# EAGLE schematic ArduinoShield_v1 (EAGLE 7.4.0)
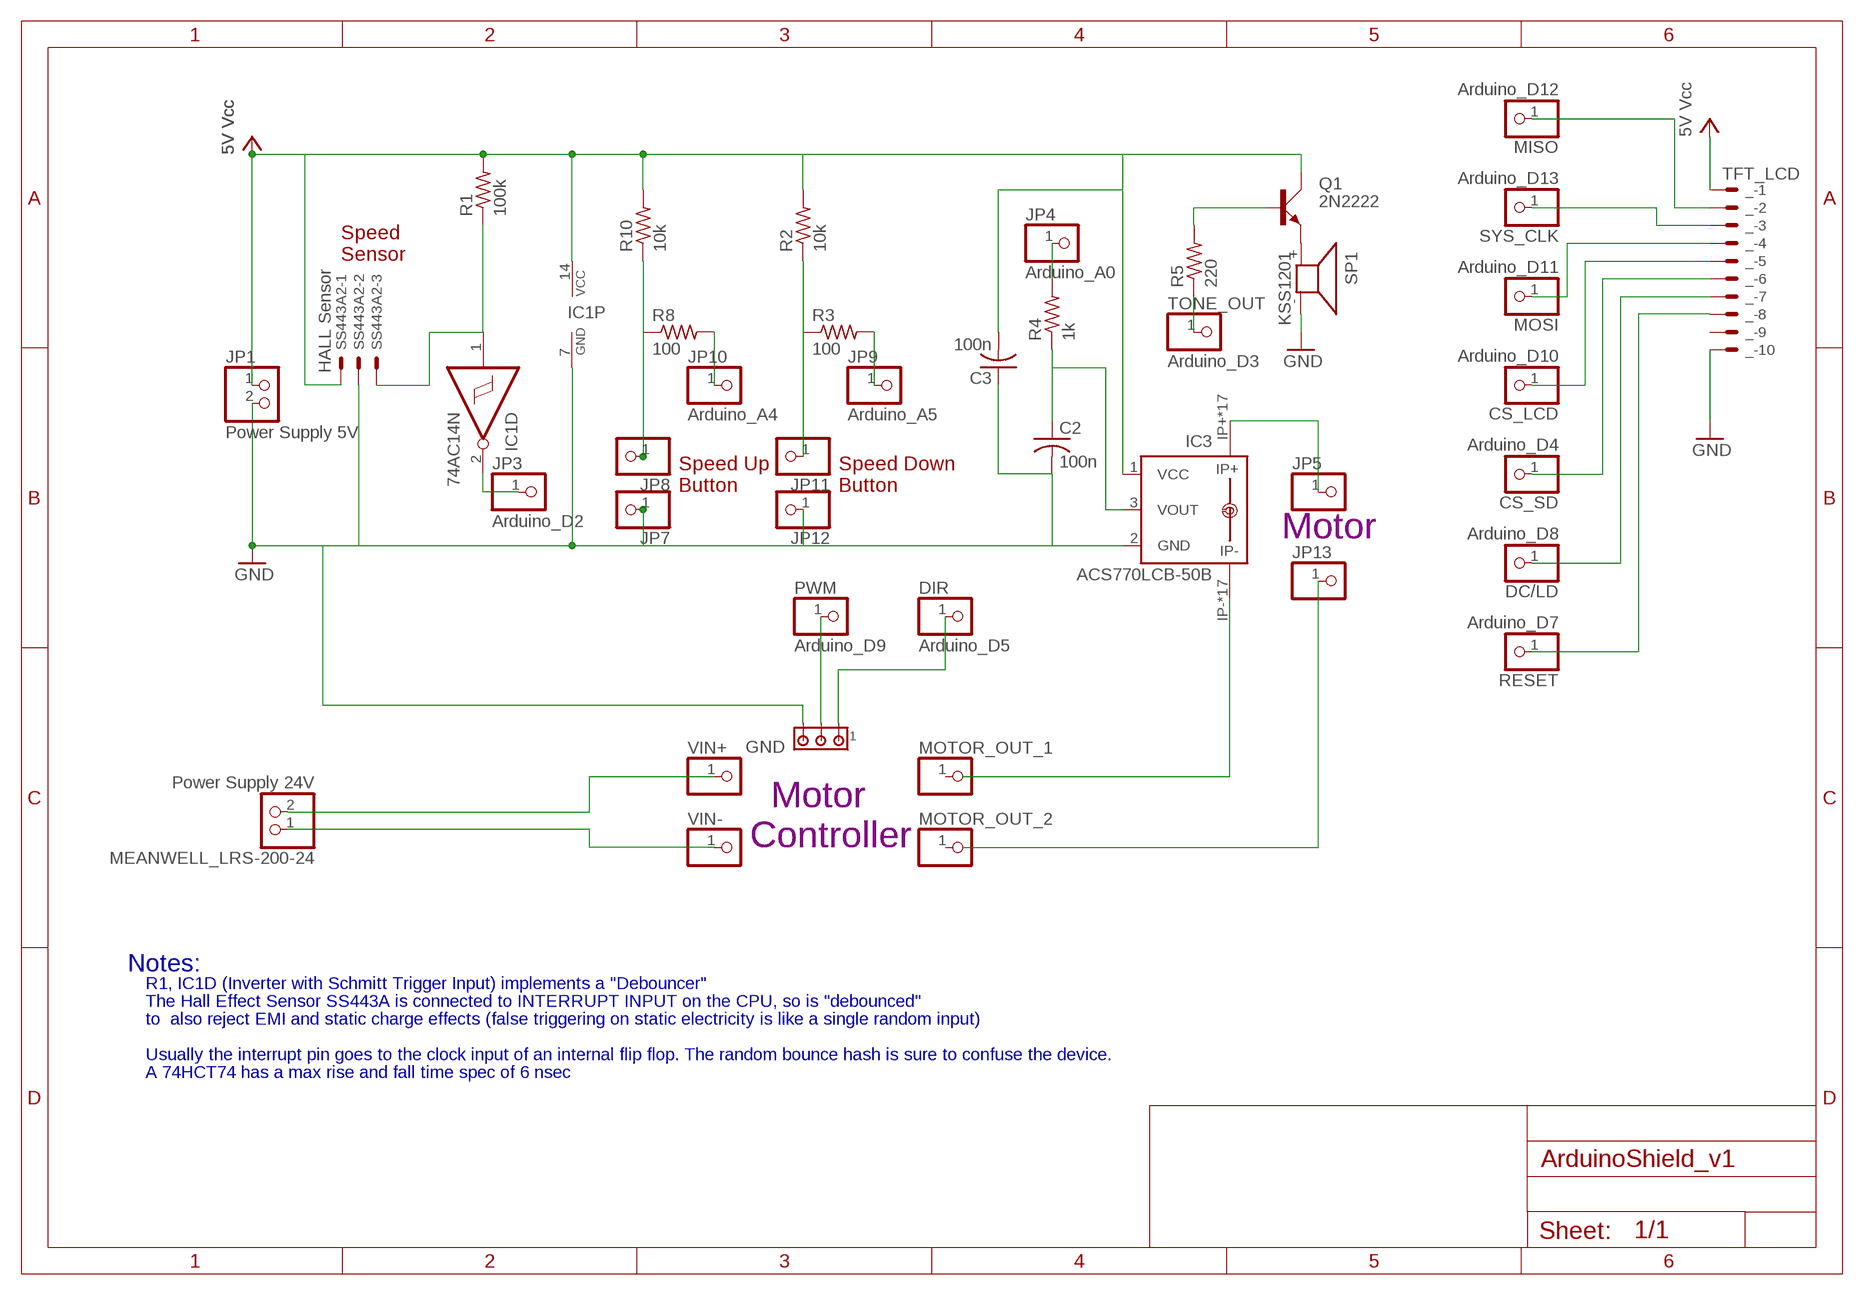
[diagram p0: schematic, sheet 1]

## Parts
_  TFT_LCD  22-23-2101  [22-23-2101]
C2  100n  C-US050-030X075  [C050-030X075]
C3  100n  C-US050-030X075  [C050-030X075]
CS_LCD  Arduino_D10  PINHD-1X1  [1X01]
CS_SD  Arduino_D4  PINHD-1X1  [1X01]
DC/LD  Arduino_D8  PINHD-1X1  [1X01]
DIR  Arduino_D5  PINHD-1X1  [1X01]
GND  350429-1  [350429-1]
IC1  74AC14N  [DIL14]
IC3  ACS770LCB-50B  ACS750LCA-050  [ACS75050]
JP1  Power Supply 5V  PINHD-1X2  [1X02]
JP3  Arduino_D2  PINHD-1X1  [1X01]
JP4  Arduino_A0  PINHD-1X1  [1X01]
JP5  PINHD-1X1  [1X01]
JP7  PINHD-1X1  [1X01]
JP8  PINHD-1X1  [1X01]
JP9  Arduino_A5  PINHD-1X1  [1X01]
JP10  Arduino_A4  PINHD-1X1  [1X01]
JP11  PINHD-1X1  [1X01]
JP12  PINHD-1X1  [1X01]
JP13  PINHD-1X1  [1X01]
MEANWELL_LRS-200-24  Power Supply 24V  PINHD-1X2  [1X02]
MISO  Arduino_D12  PINHD-1X1  [1X01]
MOSI  Arduino_D11  PINHD-1X1  [1X01]
MOTOR_OUT_1  PINHD-1X1  [1X01]
MOTOR_OUT_2  PINHD-1X1  [1X01]
PWM  Arduino_D9  PINHD-1X1  [1X01]
Q1  2N2222  [TO18A]
R1  100k  R-US_0207/7  [0207/7]
R2  10k  R-US_0207/7  [0207/7]
R3  100  R-US_0207/7  [0207/7]
R4  1k  R-US_0207/7  [0207/7]
R5  220  R-US_0207/7  [0207/7]
R8  100  R-US_0207/7  [0207/7]
R10  10k  R-US_0207/7  [0207/7]
RESET  Arduino_D7  PINHD-1X1  [1X01]
SP1  KSS1201  [KSS1201]
SS443A2  HALL Sensor  22-23-2031  [22-23-2031]
SYS_CLK  Arduino_D13  PINHD-1X1  [1X01]
TONE_OUT  Arduino_D3  PINHD-1X1  [1X01]
VIN+  PINHD-1X1  [1X01]
VIN-  PINHD-1X1  [1X01]

## Nets
ARD: JP4.1 R4.2
GND: _.10 C2.2 C3.1 GND.3 IC1.7(P:GND) IC3.2(GND) JP1.2 JP7.1 JP12.1 SP1.- SS443A2.2
N$1: C2.1 IC3.3(VOUT) R4.1
N$2: JP11.1 R2.1
N$3: JP9.1 R3.2
N$4: IC3.IP+ IC3.IP+@2(IP+) IC3.IP+@3(IP+) IC3.IP+@4(IP+) IC3.IP+@5(IP+) IC3.IP+@6(IP+) IC3.IP+@7(IP+) IC3.IP+@8(IP+) IC3.IP+@9(IP+) IC3.IP+@10(IP+) IC3.IP+@11(IP+) IC3.IP+@12(IP+) IC3.IP+@13(IP+) IC3.IP+@14(IP+) IC3.IP+@15(IP+) IC3.IP+@16(IP+) IC3.IP+@17(IP+) JP5.1
N$5: IC3.IP- IC3.IP-@2(IP-) IC3.IP-@3(IP-) IC3.IP-@4(IP-) IC3.IP-@5(IP-) IC3.IP-@6(IP-) IC3.IP-@7(IP-) IC3.IP-@8(IP-) IC3.IP-@9(IP-) IC3.IP-@10(IP-) IC3.IP-@11(IP-) IC3.IP-@12(IP-) IC3.IP-@13(IP-) IC3.IP-@14(IP-) IC3.IP-@15(IP-) IC3.IP-@16(IP-) IC3.IP-@17(IP-)
N$6: IC1.2(D:O) JP3.1
N$7: MEANWELL_LRS-200-24.2 VIN+.1
N$8: MEANWELL_LRS-200-24.1 VIN-.1
N$9: IC1.1(D:I) R1.1 SS443A2.3
N$10: JP8.1 R8.1 R10.1
N$11: DIR.1 GND.1
N$12: JP13.1
N$13: JP10.1 R8.2
N$14: Q1.E SP1.+
N$15: R5.1 TONE_OUT.1
N$16: _.2 MISO.1
N$17: _.3 SYS_CLK.1
N$18: _.4 MOSI.1
N$19: _.5 CS_LCD.1
N$20: _.6 CS_SD.1
N$21: _.7 DC/LD.1
N$22: _.8 RESET.1
N$23: Q1.B R5.2
PWM: GND.2 PWM.1
VCC: _.1 C3.2 IC1.14(P:VCC) IC3.1(VCC) JP1.1 Q1.C R1.2 R2.2 R10.2 SS443A2.1 ; supply symbol labelled 5V Vcc
Unconnected: _.9 IC1.3(E:I) IC1.4(E:O) IC1.5(F:I) IC1.6(F:O) IC1.8(C:O) IC1.9(C:I) IC1.10(B:O) IC1.11(B:I) IC1.12(A:O) IC1.13(A:I) MOTOR_OUT_1.1 MOTOR_OUT_2.1 R3.1

## Notes on the sheet
- Speed 
  Sensor
- Speed Up
  Button
- Speed Down
  Button
- Motor
- Motor
  Controller
- Notes:
- R1, IC1D (Inverter with Schmitt Trigger Input) implements a "Debouncer"
- The Hall Effect Sensor SS443A is connected to INTERRUPT INPUT on the CPU, so is "debounced"
- to  also reject EMI and static charge effects (false triggering on static electricity is like a single random input)
- Usually the interrupt pin goes to the clock input of an internal flip flop. The random bounce hash is sure to confuse the device.
- A 74HCT74 has a max rise and fall time spec of 6 nsec

## Library data of the parts
_ = con-molex:22-23-2101: .100" (2.54mm) Center Header - 10 Pin; MF: MOLEX; MPN: 22-23-2101; OC_FARNELL: 1756828; OC_NEWARK: 94C0765
C2 C3 = rcl:C-US: CAPACITOR, American symbol
CS_LCD CS_SD DC/LD DIR JP3-JP5 JP7-JP13 MISO MOSI MOTOR_OUT_1 MOTOR_OUT_2 PWM RESET SYS_CLK TONE_OUT VIN+ VIN- = pinhead:PINHD-1X1: PIN HEADER
GND = con-amp:350429-1: Universal MATE-N-LOK .250" Centerline, 600 V, 19 - 36 A max Source: http://catalog.tycoelectronics.com/ .. ENG_CD_350429_Y.pdf
IC1 = 74xx-eu:74*14: Hex schmitt trigger INVERTER
IC3 = allegro:ACS750*CA-050: Current Sensor display layer 49 Reference in BRD and place VIAs on circles Source: www.allegromicro.com/datafile/0750-050.pdf; MF: ALLEGRO MICROSYSTEMS, INC.; MPN: ACS750LCA-050; OC_FARNELL: 1457176; OC_NEWARK: 61H4464
JP1 MEANWELL_LRS-200-24 = pinhead:PINHD-1X2: PIN HEADER
Q1 = transistor-small-signal:2N2222: NPN TRANSISTOR
R1-R5 R8 R10 = resistor:R-US_: RESISTOR, American symbol
SP1 = buzzer:KSS1201: SPEAKER Source: Schukat; OC_FARNELL: unknown; OC_NEWARK: unknown
SS443A2 = con-molex:22-23-2031: .100" (2.54mm) Center Header - 3 Pin; MF: MOLEX; MPN: 22-23-2031; OC_FARNELL: 1462950; OC_NEWARK: 30C0862